# EAGLE design ziggy (EAGLE 9.6.2)
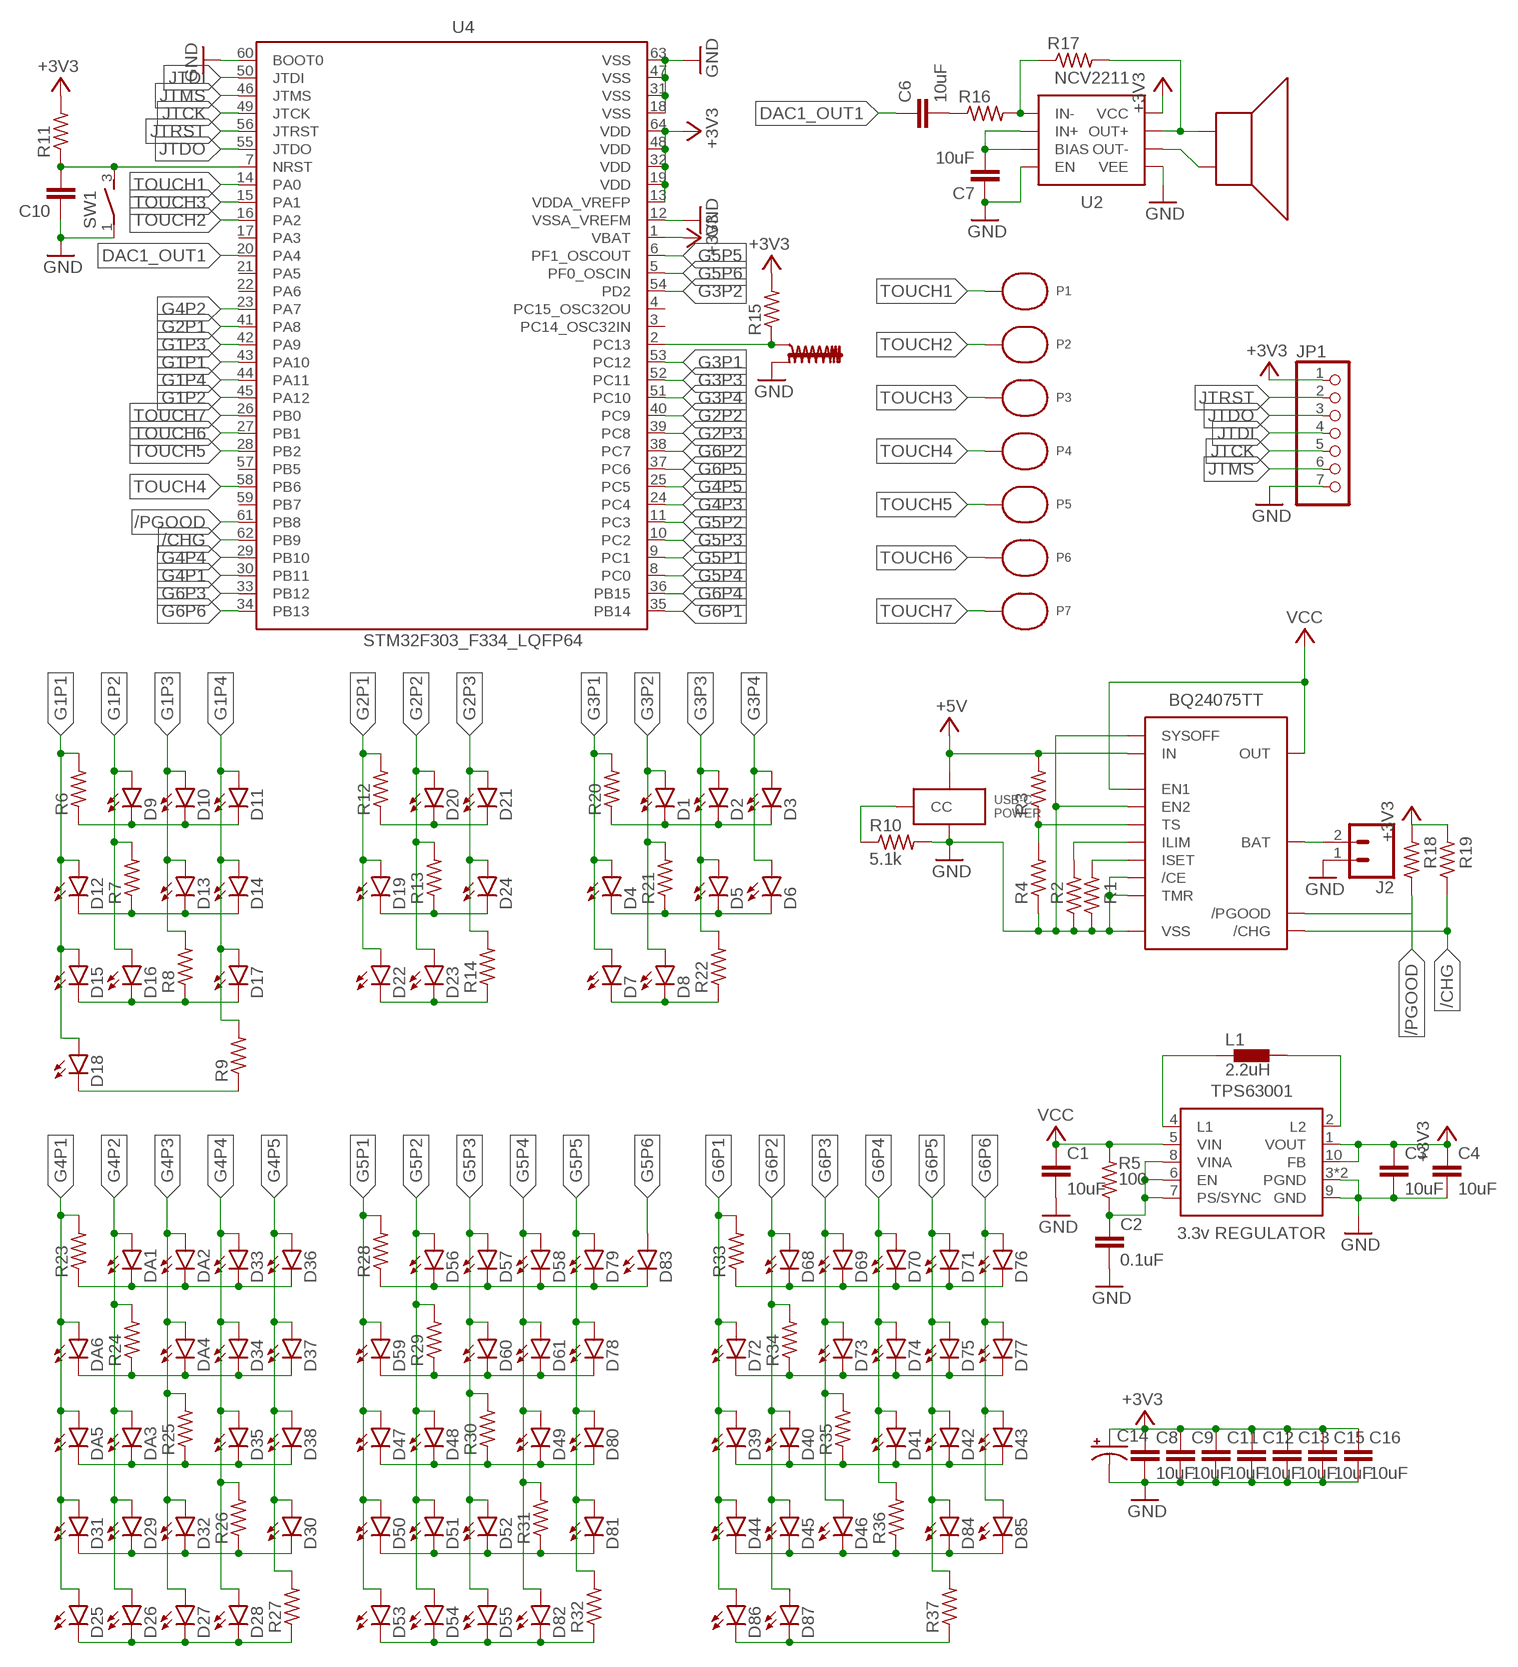
[diagram p0: schematic, sheet 1]

## Parts
C1  10uF  C-EUC0805  [C0805]
C2  0.1uF  C-EUC0805  [C0805]
C3  10uF  C-EUC0805  [C0805]
C4  10uF  C-EUC0805  [C0805]
C6  10uF  C-EUC0805  [C0805]
C7  10uF  C-EUC0805  [C0805]
C8  10uF  C-EUC0805  [C0805]
C9  10uF  C-EUC0805  [C0805]
C10  C-EUC0805  [C0805]
C11  10uF  C-EUC0805  [C0805]
C12  10uF  C-EUC0805  [C0805]
C13  10uF  C-EUC0805  [C0805]
C14  CPOL-US153CLV-0810  [153CLV-0810]
C15  10uF  C-EUC0805  [C0805]
C16  10uF  C-EUC0805  [C0805]
D1  LED-0805  [CHIPLED_0805]
D2  LED-0805  [CHIPLED_0805]
D3  LED-0805  [CHIPLED_0805]
D4  LED-0805  [CHIPLED_0805]
D5  LED-0805  [CHIPLED_0805]
D6  LED-0805  [CHIPLED_0805]
D7  LED-0805  [CHIPLED_0805]
D8  LED-0805  [CHIPLED_0805]
D9  LED-0805  [CHIPLED_0805]
D10  LED-0805  [CHIPLED_0805]
D11  LED-0805  [CHIPLED_0805]
D12  LED-0805  [CHIPLED_0805]
D13  LED-0805  [CHIPLED_0805]
D14  LED-0805  [CHIPLED_0805]
D15  LED-0805  [CHIPLED_0805]
D16  LED-0805  [CHIPLED_0805]
D17  LED-0805  [CHIPLED_0805]
D18  LED-0805  [CHIPLED_0805]
D19  LED-0805  [CHIPLED_0805]
D20  LED-0805  [CHIPLED_0805]
D21  LED-0805  [CHIPLED_0805]
D22  LED-0805  [CHIPLED_0805]
D23  LED-0805  [CHIPLED_0805]
D24  LED-0805  [CHIPLED_0805]
D25  LED-0805  [CHIPLED_0805]
D26  LED-0805  [CHIPLED_0805]
D27  LED-0805  [CHIPLED_0805]
D28  LED-0805  [CHIPLED_0805]
D29  LED-0805  [CHIPLED_0805]
D30  LED-0805  [CHIPLED_0805]
D31  LED-0805  [CHIPLED_0805]
D32  LED-0805  [CHIPLED_0805]
D33  LED-0805  [CHIPLED_0805]
D34  LED-0805  [CHIPLED_0805]
D35  LED-0805  [CHIPLED_0805]
D36  LED-0805  [CHIPLED_0805]
D37  LED-0805  [CHIPLED_0805]
D38  LED-0805  [CHIPLED_0805]
D39  LED-0805  [CHIPLED_0805]
D40  LED-0805  [CHIPLED_0805]
D41  LED-0805  [CHIPLED_0805]
D42  LED-0805  [CHIPLED_0805]
D43  LED-0805  [CHIPLED_0805]
D44  LED-0805  [CHIPLED_0805]
D45  LED-0805  [CHIPLED_0805]
D46  LED-0805  [CHIPLED_0805]
D47  LED-0805  [CHIPLED_0805]
D48  LED-0805  [CHIPLED_0805]
D49  LED-0805  [CHIPLED_0805]
D50  LED-0805  [CHIPLED_0805]
D51  LED-0805  [CHIPLED_0805]
D52  LED-0805  [CHIPLED_0805]
D53  LED-0805  [CHIPLED_0805]
D54  LED-0805  [CHIPLED_0805]
D55  LED-0805  [CHIPLED_0805]
D56  LED-0805  [CHIPLED_0805]
D57  LED-0805  [CHIPLED_0805]
D58  LED-0805  [CHIPLED_0805]
D59  LED-0805  [CHIPLED_0805]
D60  LED-0805  [CHIPLED_0805]
D61  LED-0805  [CHIPLED_0805]
D68  LED-0805  [CHIPLED_0805]
D69  LED-0805  [CHIPLED_0805]
D70  LED-0805  [CHIPLED_0805]
D71  LED-0805  [CHIPLED_0805]
D72  LED-0805  [CHIPLED_0805]
D73  LED-0805  [CHIPLED_0805]
D74  LED-0805  [CHIPLED_0805]
D75  LED-0805  [CHIPLED_0805]
D76  LED-0805  [CHIPLED_0805]
D77  LED-0805  [CHIPLED_0805]
D78  LED-0805  [CHIPLED_0805]
D79  LED-0805  [CHIPLED_0805]
D80  LED-0805  [CHIPLED_0805]
D81  LED-0805  [CHIPLED_0805]
D82  LED-0805  [CHIPLED_0805]
D83  LED-0805  [CHIPLED_0805]
D84  LED-0805  [CHIPLED_0805]
D85  LED-0805  [CHIPLED_0805]
D86  LED-0805  [CHIPLED_0805]
D87  LED-0805  [CHIPLED_0805]
DA1  LED-0805  [CHIPLED_0805]
DA2  LED-0805  [CHIPLED_0805]
DA3  LED-0805  [CHIPLED_0805]
DA4  LED-0805  [CHIPLED_0805]
DA5  LED-0805  [CHIPLED_0805]
DA6  LED-0805  [CHIPLED_0805]
J1  USB-C-POWER  [USB-C]
J2  CONN_02-JST-2MM-SMT  [JST-2-SMD]
JP1  PINHD-1X7/90  [1X07/90]
L1  2.2uH  LPS3015  [LPS3015]
P1  CAPTOUCH  [CAPTOUCH]
P2  CAPTOUCH  [CAPTOUCH]
P3  CAPTOUCH  [CAPTOUCH]
P4  CAPTOUCH  [CAPTOUCH]
P5  CAPTOUCH  [CAPTOUCH]
P6  CAPTOUCH  [CAPTOUCH]
P7  CAPTOUCH  [CAPTOUCH]
R1  R-US_R0805  [R0805]
R2  R-US_R0805  [R0805]
R3  R-US_R0805  [R0805]
R4  R-US_R0805  [R0805]
R5  100  R-US_R0805  [R0805]
R6  R-US_R0805  [R0805]
R7  R-US_R0805  [R0805]
R8  R-US_R0805  [R0805]
R9  R-US_R0805  [R0805]
R10  5.1k  R-US_R0805  [R0805]
R11  R-US_R0805  [R0805]
R12  R-US_R0805  [R0805]
R13  R-US_R0805  [R0805]
R14  R-US_R0805  [R0805]
R15  R-US_R0805  [R0805]
R16  R-US_R0805  [R0805]
R17  R-US_R0805  [R0805]
R18  R-US_R0805  [R0805]
R19  R-US_R0805  [R0805]
R20  R-US_R0805  [R0805]
R21  R-US_R0805  [R0805]
R22  R-US_R0805  [R0805]
R23  R-US_R0805  [R0805]
R24  R-US_R0805  [R0805]
R25  R-US_R0805  [R0805]
R26  R-US_R0805  [R0805]
R27  R-US_R0805  [R0805]
R28  R-US_R0805  [R0805]
R29  R-US_R0805  [R0805]
R30  R-US_R0805  [R0805]
R31  R-US_R0805  [R0805]
R32  R-US_R0805  [R0805]
R33  R-US_R0805  [R0805]
R34  R-US_R0805  [R0805]
R35  R-US_R0805  [R0805]
R36  R-US_R0805  [R0805]
R37  R-US_R0805  [R0805]
SP1  CMS-151103-088SP  [CMS-151103]
SW1  AS11CH  [AS11CH]
SW2  ADAFRUIT1767  [ADAFRUIT1767]
U1  BQ24075TT  [QFN50P300X300X100-17T168N]
U2  NCV2211  [SOIC127P600X175-8N]
U3  TPS63001  [SON50P300X300X100-11T165X240N]
U4  STM32F303_F334_LQFP64  [LQFP64_PACKAGE]

## Nets
+3V3: C3.1 C4.1 C8.1 C9.1 C11.1 C12.1 C13.1 C14.+ C15.1 C16.1 JP1.1 R11.2 R15.2 R18.2 R19.2 U2.6(VCC) U3.1(VOUT) U3.10(FB) U4.1(VBAT) U4.13(VDDA_VREFP) U4.19(VDD) U4.32(VDD) U4.48(VDD) U4.64(VDD)
+5V: J1.VBUS1(VBUS) J1.VBUS2(VBUS) R3.2 U1.13(IN)
/CHG: R19.1 U1.9(/CHG) U4.62(PB9)
/PGOOD: R18.1 U1.7(/PGOOD) U4.61(PB8)
DAC1_OUT1: C6.1 U4.20(PA4)
G1P1: D12.A D15.A D18.A R6.2 U4.43(PA10)
G1P2: D9.A D16.A R7.2 U4.45(PA12)
G1P3: D10.A D13.A R8.2 U4.42(PA9)
G1P4: D11.A D14.A D17.A R9.2 U4.44(PA11)
G2P1: D19.A D22.A R12.2 U4.41(PA8)
G2P2: D20.A D23.A R13.2 U4.40(PC9)
G2P3: D21.A D24.A R14.2 U4.39(PC8)
G3P1: D4.A D7.A R20.2 U4.53(PC12)
G3P2: D1.A D8.A R21.2 U4.54(PD2)
G3P3: D2.A D5.A R22.2 U4.52(PC11)
G3P4: D3.A D6.A U4.51(PC10)
G4P1: D25.A D31.A DA5.A DA6.A R23.2 U4.30(PB11)
G4P2: D26.A D29.A DA1.A DA3.A R24.2 U4.23(PA7)
G4P3: D27.A D32.A DA2.A DA4.A R25.2 U4.24(PC4)
G4P4: D28.A D33.A D34.A D35.A R26.2 U4.29(PB10)
G4P5: D30.A D36.A D37.A D38.A R27.2 U4.25(PC5)
G5P1: D47.A D50.A D53.A D59.A R28.2 U4.9(PC1)
G5P2: D48.A D51.A D54.A D56.A R29.2 U4.11(PC3)
G5P3: D52.A D55.A D57.A D60.A R30.2 U4.10(PC2)
G5P4: D49.A D58.A D61.A D82.A R31.2 U4.8(PC0)
G5P5: D78.A D79.A D80.A D81.A R32.2 U4.6(PF1_OSCOUT)
G5P6: D83.A U4.5(PF0_OSCIN)
G6P1: D39.A D44.A D72.A D86.A R33.2 U4.35(PB14)
G6P2: D40.A D45.A D68.A D87.A R34.2 U4.38(PC7)
G6P3: D46.A D69.A D73.A R35.2 U4.33(PB12)
G6P4: D41.A D70.A D74.A R36.2 U4.36(PB15)
G6P5: D42.A D71.A D75.A D84.A R37.2 U4.37(PC6)
G6P6: D43.A D76.A D77.A D85.A U4.34(PB13)
GND: C1.2 C2.2 C3.2 C4.2 C7.1 C8.2 C9.2 C10.1 C11.2 C12.2 C13.2 C14.- C15.2 C16.2 J1.GND1(GND) J1.GND2(GND) J2.1 JP1.7 R1.1 R2.1 R4.1 R10.2 SW1.1(P) SW2.2(VSS) U1.4(/CE) U1.5(EN2) U1.8(VSS) U1.14(TMR) U1.15(SYSOFF) U1.17(VSS) U2.1(EN) U2.7(VEE) U3.3(PGND) U3.9(GND) U3.11(PGND) U4.12(VSSA_VREFM) U4.18(VSS) U4.31(VSS) U4.47(VSS) U4.60(BOOT0) U4.63(VSS)
JTCK: JP1.5 U4.49(JTCK)
JTDI: JP1.4 U4.50(JTDI)
JTDO: JP1.3 U4.55(JTDO)
JTMS: JP1.6 U4.46(JTMS)
JTRST: JP1.2 U4.56(JTRST)
N$1: R1.2 U1.16(ISET)
N$2: R2.2 U1.12(ILIM)
N$3: J2.2 U1.2(BAT) U1.3(BAT)
N$4: R3.1 R4.2 U1.1(TS)
N$5: L1.1 U3.4(L1)
N$6: L1.2 U3.2(L2)
N$7: C2.1 R5.1 U3.6(EN) U3.7(PS/SYNC) U3.8(VINA)
N$8: D9.C D10.C D11.C R6.1
N$9: D12.C D13.C D14.C R7.1
N$10: D15.C D16.C D17.C R8.1
N$11: D18.C R9.1
N$12: J1.CC1(CC) J1.CC2(CC) R10.1
N$13: D20.C D21.C R12.1
N$14: D19.C D24.C R13.1
N$15: D22.C D23.C R14.1
N$16: R16.2 R17.1 U2.4(IN-)
N$17: C6.2 R16.1
N$18: C7.2 U2.2(BIAS) U2.3(IN+)
N$19: D7.C D8.C R22.1
N$20: R17.2 SP1.2(VSS) U2.5(OUT+)
N$21: D4.C D5.C D6.C R21.1
N$22: D1.C D2.C D3.C R20.1
N$23: SP1.1(VSS) U2.8(OUT-)
N$24: D33.C D36.C DA1.C DA2.C R23.1
N$25: D34.C D37.C DA4.C DA6.C R24.1
N$26: D35.C D38.C DA3.C DA5.C R25.1
N$27: D29.C D30.C D31.C D32.C R26.1
N$28: D25.C D26.C D27.C D28.C R27.1
N$34: D56.C D57.C D58.C D79.C D83.C R28.1
N$35: D59.C D60.C D61.C D78.C R29.1
N$36: D47.C D48.C D49.C D80.C R30.1
N$37: D50.C D51.C D52.C D81.C R31.1
N$38: D53.C D54.C D55.C D82.C R32.1
N$45: D68.C D69.C D70.C D71.C D76.C R33.1
N$46: D72.C D73.C D74.C D75.C D77.C R34.1
N$47: D39.C D40.C D41.C D42.C D43.C R35.1
N$48: D44.C D45.C D46.C D84.C D85.C R36.1
N$49: D86.C D87.C R37.1
NRST: C10.2 R11.1 SW1.3(S) U4.7(NRST)
TOUCH1: P1.P$1 U4.14(PA0)
TOUCH2: P2.P$1 U4.16(PA2)
TOUCH3: P3.P$1 U4.15(PA1)
TOUCH4: P4.P$1 U4.58(PB6)
TOUCH5: P5.P$1 U4.28(PB2)
TOUCH6: P6.P$1 U4.27(PB1)
TOUCH7: P7.P$1 U4.26(PB0)
VCC: C1.1 R5.2 U1.6(EN1) U1.10(OUT) U1.11(OUT) U3.5(VIN)
VIBR_SENS: R15.1 SW2.1(VSS) U4.2(PC13)
Unconnected: U4.3(PC14_OSC32IN) U4.4(PC15_OSC32OU) U4.17(PA3) U4.21(PA5) U4.22(PA6) U4.57(PB5) U4.59(PB7)

## Library data of the parts
C1-C4 C6-C13 C15 C16 = rcl:C-EU: CAPACITOR, European symbol; SPICEPREFIX: C
C14 = rcl:CPOL-US: POLARIZED CAPACITOR, American symbol; SPICEPREFIX: C
D1-D61 D68-D87 DA1-DA6 = ziggy:LED-0805
J1 = ziggy:USB-C-POWER
J2 = SparkFun-Connectors:CONN_02: Multi connection point. Often used as Generic Header-pin footprint for 0.1 inch spaced/style header connections On any of the 0.1 inch spaced packages, you can populate with these: Break Away Headers - Straight <https://www.sparkfun.com/products/116> (PRT-00116) Break Away Male Headers - Right Angle <https://www.sparkfun.com/products/553> (PRT-00553) Female Headers <https://www.sparkfun.com/products/115> (PRT-00115) Break Away Headers - Machine Pin <https://www.sparkfun.com/products/117> (PRT-00117) Break Away Female Headers - Swiss Machine Pin <https://www.sparkfun.com/products/743> (PRT-00743) For SCREWTERMINALS and SPRING TERMINALS visit here: Screw Terimnals on SparkFun.com <https://www.sparkfun.com/search/results?term=Screw+Terminals> (5mm/3.5mm/2.54mm spacing) This device is also useful as a general connection point to wire up your design to another part of your project. Our various solder wires solder well into these plated through hole pads. Hook-Up Wire - Assortment (Stranded, 22 AWG) <https://www.sparkfun.com/products/11375> (PRT-11375) Hook-Up Wire - Assortment (Solid Core, 22 AWG) <https://www.sparkfun.com/products/11367> (PRT-11367) View the entire wire category on our website here <https://www.sparkfun.com/categories/141> Special notes: Molex polarized connector foot print use with: PRT-08233 with associated crimp pins and housings. 2.54_SCREWTERM for use with PRT-10571. 3.5mm Screw Terminal footprints for PRT-08084 5mm Screw Terminal footprints for use with PRT-08432; PROD_ID: CONN-11443
JP1 = pinhead:PINHD-1X7: PIN HEADER
L1 = ziggy:LPS3015
P1-P7 = ziggy:CAPTOUCH
R1-R37 = rcl:R-US_: RESISTOR, American symbol; SPICEPREFIX: R
SP1 = ziggy:CMS-151103-088SP
SW1 = ziggy:AS11CH
SW2 = ziggy:ADAFRUIT1767
U1 = ziggy:BQ24075TT
U2 = ziggy:NCV2211
U3 = ziggy:TPS63001
U4 = ziggy:STM32F303_F334_LQFP64: STM32F303_F334_LQFP64 edit this description Auto generated by make-symbol-device-package-bsdl.ulp Rev. 44 Source: STM32F303_F334_LQFP64.bsd

## Board
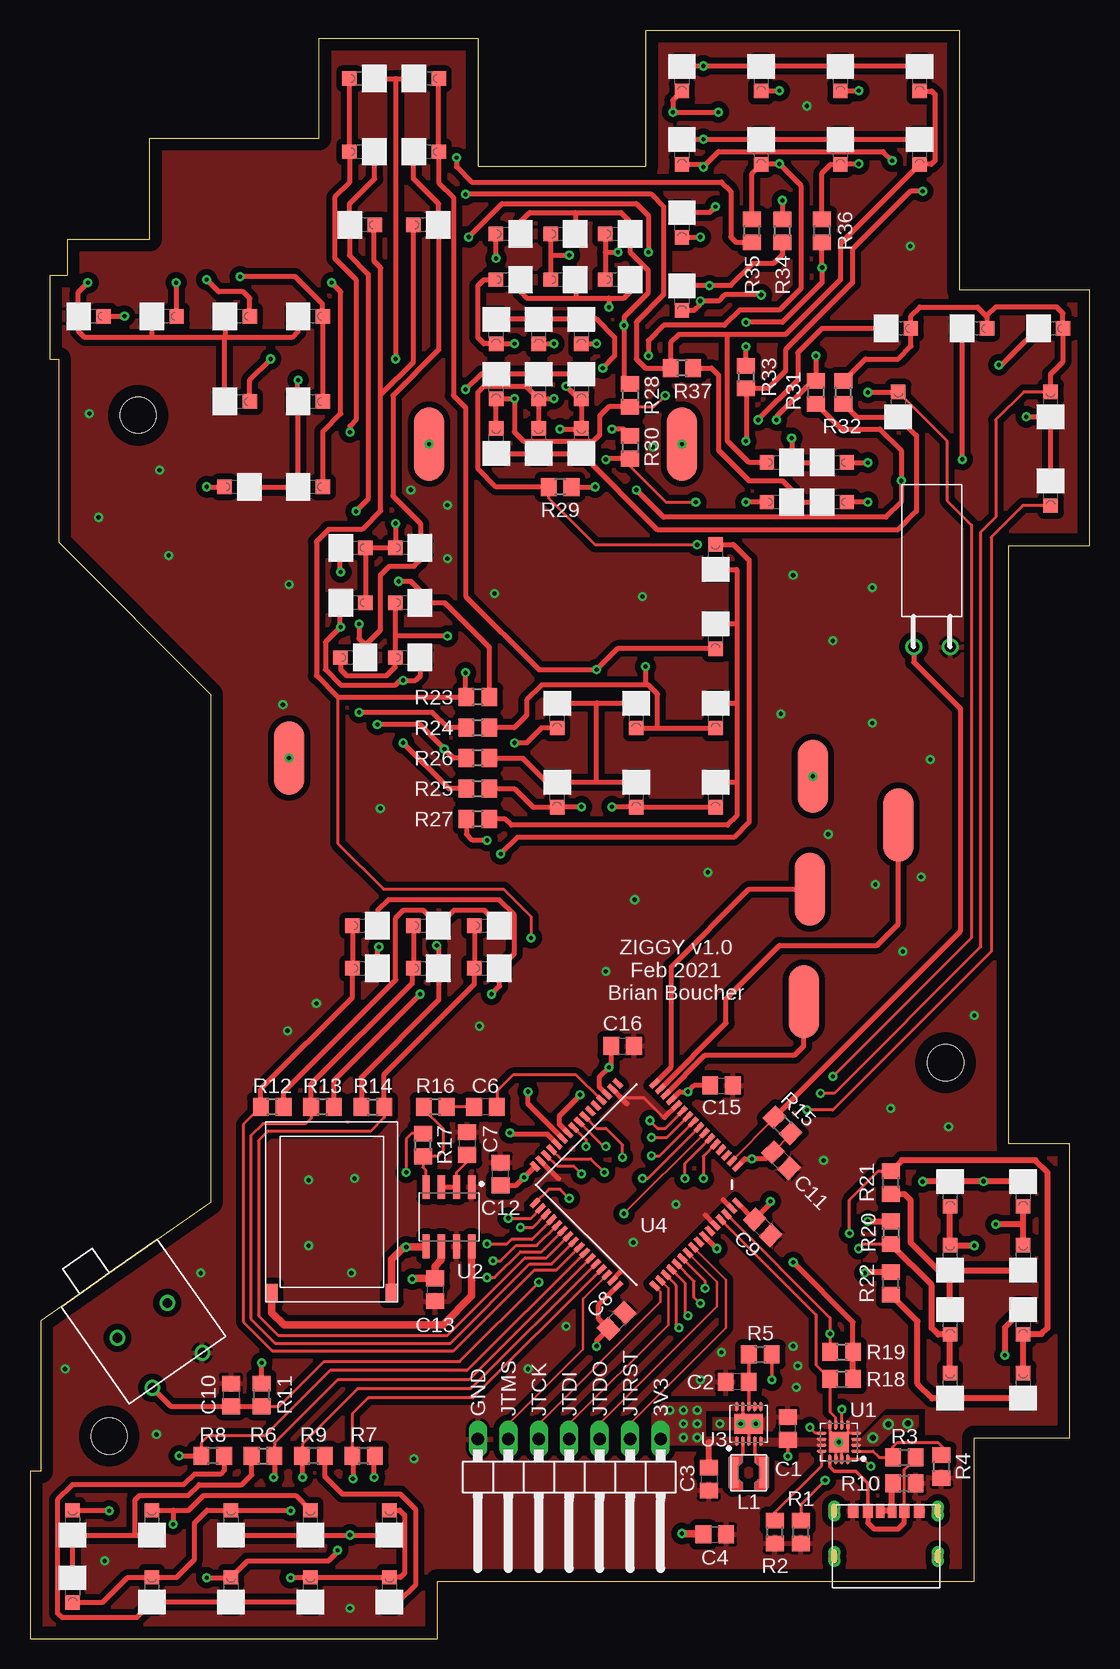
[diagram p1: board, top side]
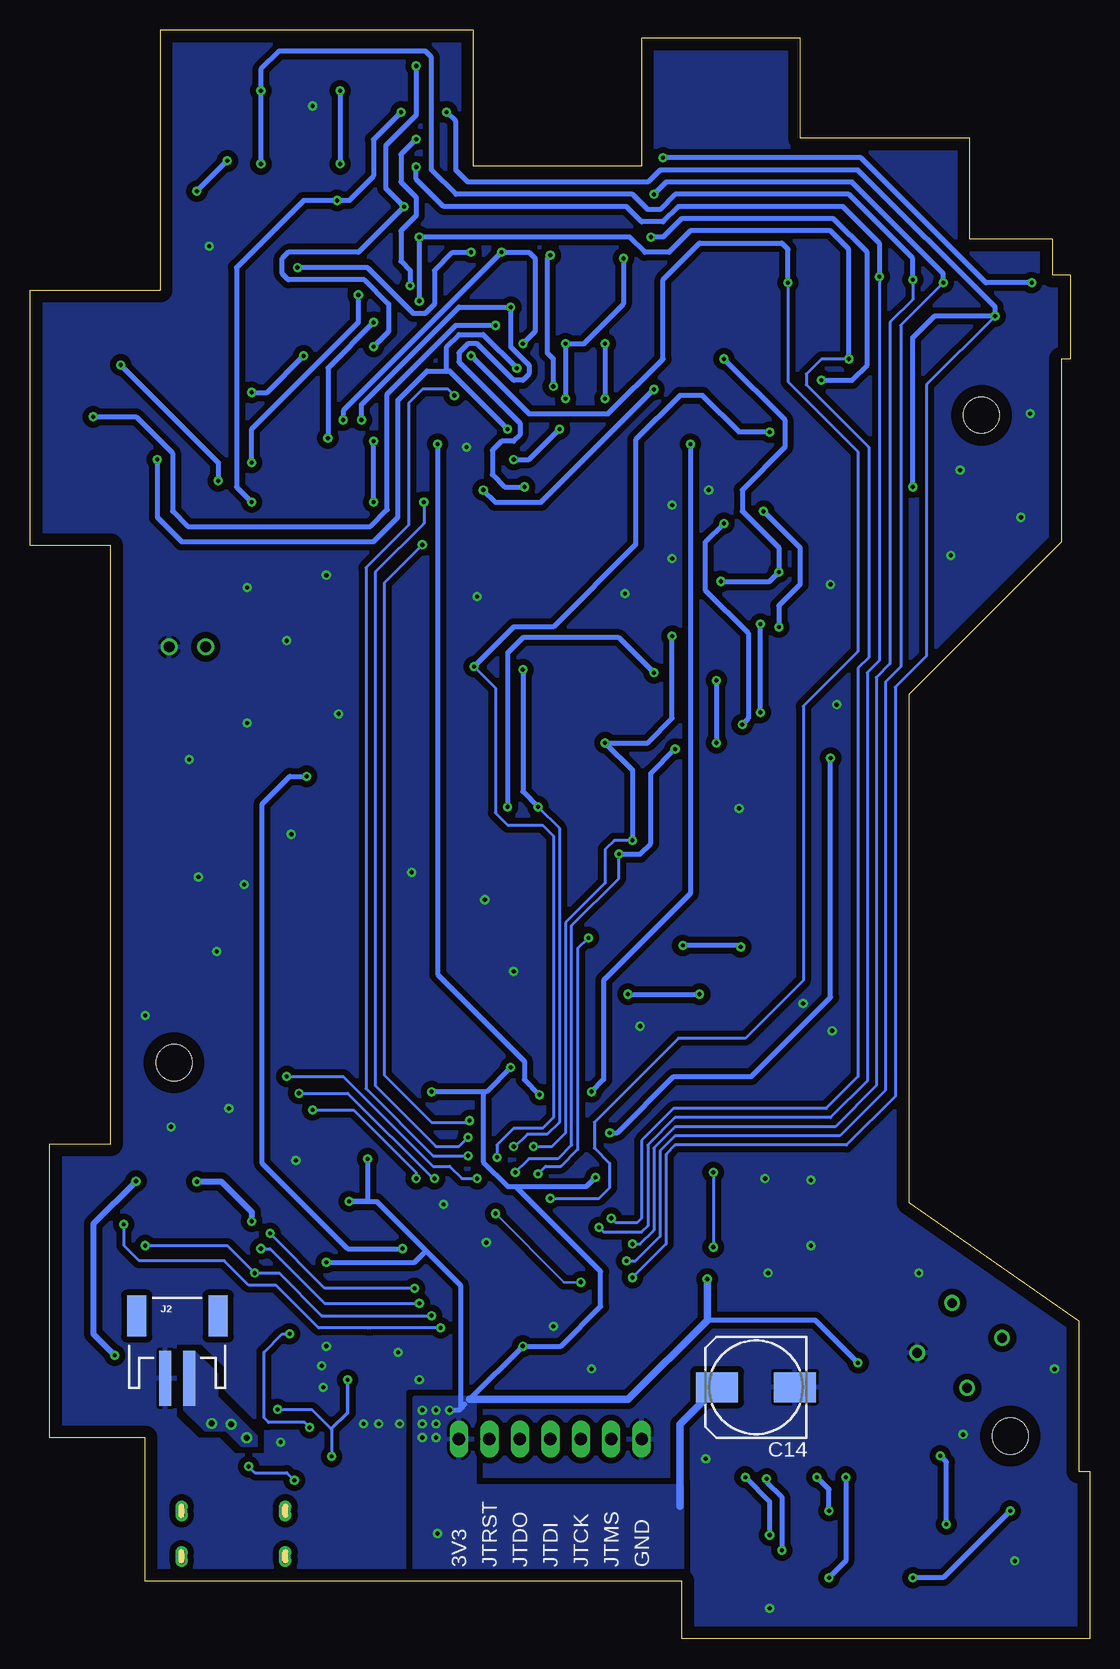
[diagram p2: board, bottom side, seen from below]

Size 88.34 x 134.1 mm. Coordinates in mm from the lower left corner, seen from the top.
Outline: 3.1,116.68 3.1,113.67 1.63,113.67 1.63,106.68 2.38,106.68 2.38,91.39 15.05,78.71 15.05,36.38 0.91,26.48 0.91,13.94 0,13.94 0,0 33.98,0 33.98,4.77 78.74,4.77 78.74,16.74 86.68,16.74 86.68,41.25 81.61,41.25 81.61,91.13 88.33,91.13 88.33,112.41 77.49,112.41 77.49,134.1 51.36,134.1 51.36,122.75 37.34,122.75 37.34,133.39 24.09,133.39 24.09,125.06 9.98,125.06 9.98,116.68 3.1,116.68
Copper layers (1*16): Top 0.035mm / dielectric 1.5mm / Bottom 0.035mm
Design rules "default *": minimum track width 6mil, minimum drill 0.35mm, track to track 6mil, track to pad 6mil, pad to pad 6mil, via to via 6mil, smd to smd 6mil, copper to edge 40mil, drill to drill 6mil, minimum pad ring 10mil, minimum via ring 8mil, stop-mask expansion 4mil, vias tented up to drill 25mil, thermal gap 10mil
Holes 3 mm at 6.6,16.89 76.33,48.01 9.02,101.98

### Footprints (pad centres in the part's own frame; a part is rotated, then mirrored left to right if it is on the bottom)
C0805 = smd 1.3 x 1.5: 1 -0.95,0; 2 0.95,0
153CLV-0810 = smd 3.5 x 2.5: + 3.25,0; - -3.25,0
CHIPLED_0805 = smd 1.2 x 1.2: A 0,-1.05; C 0,1.05
USB-C = smd 0.7 x 1.15: CC1 -0.5,3.8; CC2 0.5,3.8 | smd 0.9 x 1.15: GND1 -2.75,3.8; GND2 2.75,3.8 | drill 0.5 pad 1: SHIELD1 -4.32,-0.35; SHIELD2 -4.32,0.35; SHIELD3 -4.32,3.45; SHIELD4 -4.32,4.15; SHIELD5 4.32,-0.35; SHIELD6 4.32,0.35; SHIELD7 4.32,3.45; SHIELD8 4.32,4.15 | smd 0.8 x 1.15: VBUS1 -1.52,3.8; VBUS2 1.52,3.8
JST-2-SMD = smd 1 x 4.6: 1 -1,-3.7; 2 1,-3.7 | smd 1.6 x 3.4: NC1 -3.4,1.5; NC2 3.4,1.5
1X07/90 = drill 1.016 long: 1 -7.62,-3.81; 2 -5.08,-3.81; 3 -2.54,-3.81; 4 0,-3.81; 5 2.54,-3.81; 6 5.08,-3.81; 7 7.62,-3.81
LPS3015 = smd 0.762 x 2.54: 1 -1.27,0; 2 1.27,0
CAPTOUCH = smd 2.54 x 6.096: P$1 0,0
R0805 = smd 1.3 x 1.5: 1 -0.95,0; 2 0.95,0
CMS-151103 = smd 1 x 1.5: 1 -5,-6.75; 2 5,-6.75
AS11CH = drill 0.8: 1 -2.54,9.9; 3 2.54,9.9; SHIELD1 -2.54,4.82; SHIELD2 2.54,4.82
ADAFRUIT1767 = drill 0.9: 1 1.5,2.54; 2 -1.54,2.54
QFN50P300X300X100-17T168N = smd 0.86 x 0.264: 1 -1.435,0.75; 2 -1.435,0.25; 3 -1.435,-0.25; 4 -1.435,-0.75; 9 1.435,-0.75; 10 1.435,-0.25; 11 1.435,0.25; 12 1.435,0.75 | smd 0.264 x 0.86: 5 -0.75,-1.435; 6 -0.25,-1.435; 7 0.25,-1.435; 8 0.75,-1.435; 13 0.75,1.435; 14 0.25,1.435; 15 -0.25,1.435; 16 -0.75,1.435 | smd 1.68 x 1.68: 17 0,0
SOIC127P600X175-8N = smd 1.968 x 0.602: 1 -2.473,1.905; 2 -2.473,0.635; 3 -2.473,-0.635; 4 -2.473,-1.905; 5 2.473,-1.905; 6 2.473,-0.635; 7 2.473,0.635; 8 2.473,1.905
SON50P300X300X100-11T165X240N = smd 0.86 x 0.27: 1 -1.435,1; 2 -1.435,0.5; 3 -1.435,0; 4 -1.435,-0.5; 5 -1.435,-1; 6 1.435,-1; 7 1.435,-0.5; 8 1.435,0; 9 1.435,0.5; 10 1.435,1 | smd 1.65 x 2.4: 11 0,0
LQFP64_PACKAGE = smd 0.9 x 0.4: 1 -7.05,4.875; 2 -7.05,4.225; 3 -7.05,3.575; 4 -7.05,2.925; 5 -7.05,2.275; 6 -7.05,1.625; 7 -7.05,0.975; 8 -7.05,0.325; 9 -7.05,-0.325; 10 -7.05,-0.975; 11 -7.05,-1.625; 12 -7.05,-2.275; 13 -7.05,-2.925; 14 -7.05,-3.575; 15 -7.05,-4.225; 16 -7.05,-4.875; 33 7.05,-4.875; 34 7.05,-4.225; 35 7.05,-3.575; 36 7.05,-2.925; 37 7.05,-2.275; 38 7.05,-1.625; 39 7.05,-0.975; 40 7.05,-0.325; 41 7.05,0.325; 42 7.05,0.975; 43 7.05,1.625; 44 7.05,2.275; 45 7.05,2.925; 46 7.05,3.575; 47 7.05,4.225; 48 7.05,4.875 | smd 0.4 x 0.9: 17 -4.875,-7.05; 18 -4.225,-7.05; 19 -3.575,-7.05; 20 -2.925,-7.05; 21 -2.275,-7.05; 22 -1.625,-7.05; 23 -0.975,-7.05; 24 -0.325,-7.05; 25 0.325,-7.05; 26 0.975,-7.05; 27 1.625,-7.05; 28 2.275,-7.05; 29 2.925,-7.05; 30 3.575,-7.05; 31 4.225,-7.05; 32 4.875,-7.05; 49 4.875,7.05; 50 4.225,7.05; 51 3.575,7.05; 52 2.925,7.05; 53 2.275,7.05; 54 1.625,7.05; 55 0.975,7.05; 56 0.325,7.05; 57 -0.325,7.05; 58 -0.975,7.05; 59 -1.625,7.05; 60 -2.275,7.05; 61 -2.925,7.05; 62 -3.575,7.05; 63 -4.225,7.05; 64 -4.875,7.05

### Placement (x,y rotation side)
C1  63.17,17.53 90 top
C2  58.95,21.41 180 top
C3  56.59,13.31 270 top
C4  57.1,8.69 0 top
C6  37.97,44.32 180 top
C7  36.45,41.27 270 top
C8  48.91,26.51 45 top
C9  61.09,34.29 315 top
C10  16.76,20.32 270 top
C11  62.61,39.88 315 top
C12  39.24,38.73 90 top
C13  33.78,29.08 270 top
C14  27.81,20.95 180 bottom
C15  57.66,46.1 0 top
C16  49.4,49.4 0 top
D1  82.8,26.42 0 top
D2  76.71,37.08 0 top
D3  82.8,37.08 0 top
D4  76.71,26.42 0 top
D5  76.71,31.75 180 top
D6  82.8,31.75 180 top
D7  76.71,21.08 180 top
D8  82.8,21.08 180 top
D9  3.56,9.65 180 top
D10  10.16,9.65 180 top
D11  3.56,4.06 0 top
D12  29.97,9.65 180 top
D13  23.37,9.65 180 top
D14  16.76,9.65 180 top
D15  23.37,4.06 180 top
D16  16.76,4.06 180 top
D17  10.16,4.06 180 top
D18  29.97,4.06 180 top
D19  27.94,59.44 270 top
D20  33.02,59.44 270 top
D21  38.1,59.44 270 top
D22  27.94,55.88 270 top
D23  33.02,55.88 270 top
D24  38.1,55.88 270 top
D25  57.15,70.36 0 top
D26  57.15,76.96 0 top
D27  57.15,83.57 0 top
D28  57.15,90.17 180 top
D29  50.55,76.96 0 top
D30  43.94,76.96 0 top
D31  50.55,70.36 0 top
D32  43.94,70.36 0 top
D33  26.92,90.93 90 top
D34  31.5,90.93 270 top
D35  26.92,86.36 90 top
D36  31.5,86.36 270 top
D37  26.92,81.79 270 top
D38  31.5,81.79 270 top
D39  23.37,110.24 90 top
D40  5.08,110.24 90 top
D41  17.27,110.24 90 top
D42  11.18,110.24 90 top
D43  17.27,103.12 90 top
D44  23.37,103.12 90 top
D45  17.27,96.01 270 top
D46  23.37,96.01 90 top
D47  38.86,108.97 0 top
D48  42.42,108.97 0 top
D49  45.97,108.97 0 top
D50  38.86,104.39 0 top
D51  42.42,104.39 0 top
D52  45.97,104.39 0 top
D53  38.86,99.82 180 top
D54  42.42,99.82 180 top
D55  45.97,99.82 180 top
D56  39.88,117.09 270 top
D57  44.45,117.09 270 top
D58  49.02,117.09 270 top
D59  39.88,113.28 270 top
D60  44.45,113.28 270 top
D61  49.02,113.28 270 top
D68  54.36,130.05 0 top
D69  60.96,130.05 0 top
D70  67.56,130.05 0 top
D71  74.17,130.05 0 top
D72  54.36,123.95 0 top
D73  60.96,123.95 0 top
D74  67.56,123.95 0 top
D75  74.17,123.95 0 top
D76  54.36,117.86 0 top
D77  54.36,111.76 0 top
D78  72.39,109.22 90 top
D79  85.09,102.87 180 top
D80  78.74,109.22 90 top
D81  85.09,109.22 90 top
D82  72.39,102.87 180 top
D83  85.09,95.5 0 top
D84  62.48,98.04 270 top
D85  67.06,98.04 90 top
D86  62.48,94.74 270 top
D87  67.06,94.74 90 top
DA1  27.69,130.05 270 top
DA2  33.02,130.05 90 top
DA3  27.69,123.95 270 top
DA4  33.02,123.95 90 top
DA5  27.69,117.86 90 top
DA6  33.02,117.86 270 top
J1  71.37,6.86 0 top
J2  76.05,25.4 0 bottom
JP1  44.96,12.83 180 top
L1  59.92,13.84 180 top
P1  64.52,53.09 0 top
P2  65.02,62.48 0 top
P3  72.39,67.82 0 top
P4  65.28,71.88 0 top
P5  21.59,73.41 0 top
P6  33.27,99.57 0 top
P7  54.36,99.57 0 top
R1  64.26,8.89 90 top
R2  62.1,8.89 90 top
R3  72.9,15.11 0 top
R4  76,14.35 90 top
R5  60.88,23.7 0 top
R6  19.43,15.24 0 top
R7  27.81,15.24 180 top
R8  15.24,15.24 180 top
R9  23.62,15.24 180 top
R10  72.9,12.95 0 top
R11  19.3,20.32 90 top
R12  20.19,44.32 180 top
R13  24.38,44.32 180 top
R14  28.57,44.32 0 top
R15  62.74,42.8 315 top
R16  33.78,44.32 180 top
R17  32.77,41.15 90 top
R18  67.67,21.64 0 top
R19  67.67,23.9 0 top
R20  71.78,33.83 270 top
R21  71.78,38.02 90 top
R22  71.78,29.62 90 top
R23  37.34,78.49 180 top
R24  37.34,75.95 0 top
R25  37.34,70.87 0 top
R26  37.34,73.41 180 top
R27  37.34,68.33 180 top
R28  50.04,103.63 270 top
R29  44.2,96.01 180 top
R30  50.04,99.31 270 top
R31  65.53,103.89 90 top
R32  67.82,103.89 90 top
R33  59.69,105.16 270 top
R34  62.74,117.35 90 top
R35  60.2,117.35 90 top
R36  66.04,117.35 90 top
R37  54.36,105.92 180 top
SP1  25.16,35.58 0 top
SW1  6.6,30.48 215 top
SW2  75.18,85.22 180 top
U1  67.44,16.38 180 top
U2  34.92,35.18 270 top
U3  59.92,17.91 90 top
U4  50.55,37.85 225 top

### Tracks (layer width: path | path; a pad name or v marks a point on that pad's centre or on a via)
+3V3  (via drill 0.35)
  Top 0.203: C11.1 63.42,42.03 R15.2
  Top 0.406: R11.2 v19.3,22.99 | U4.48 47.37,27.78 47.37,26.7 C8.1 47.24,24.84 v47.24,24.38 | U4.64 60.33,34.96 C9.1 61.72,36.27 v61.72,36.45 | U4.1 59.6,40.01 v60.2,40.01 61.34,40.01 C11.1 | C12.1 40.52,37.78 v41.18,38.45 U4.32 | R19.2 68.62,26.38 v63.63,31.37 | U4.13 54.16,45.59 v54.86,45.59 55.37,46.1 C15.1 | U4.19 47.5,45.95 47.5,46.86 v48.26,47.62 48.45,47.82 C16.1
  Top 0.508: R18.2 R19.2 | C3.1 56.59,16.38 56.64,16.38
  Top 0.61: U2.6 34.29,31.56 33.78,31.05 C13.1 31.94,30.03 v31.88,29.97 | C4.1 56.07,8.76 v54.36,8.76
  Bottom 0.406: 51.69,19.94 v47.24,24.38 44.07,24.38 40.77,27.69 40.77,30.61 47.85,37.69 | 52.07,19.56 52.45,19.18 | 52.45,19.18 52.58,19.05 v53.34,19.05 | 55.31,32.32 59.44,36.45 v61.72,36.45 60.2,36.45 v60.2,40.01 | 55.31,32.32 52.45,29.46 52.45,19.18 | v19.3,22.99 22.86,26.54 31.88,26.54 | v63.63,31.37 56.26,31.37 55.31,32.32 | v48.26,47.62 50.29,45.59 v54.86,45.59 50.55,45.59 50.55,39.75 48.48,37.69 47.85,37.69 | 47.85,37.69 41.94,37.69 v41.18,38.45
  Bottom 0.61: v31.88,29.97 31.88,26.54 38.48,19.94 51.69,19.94 | C14.+ 34.16,17.86 34.16,11.05
  other vias: 55.63,17.91 55.63,19.05 55.63,16.76 54.48,19.05 54.48,17.91 54.48,16.76
  pour Bottom (isolate 0.508): 34.04,4.83 56.24,4.83 56.24,20.07 51.31,20.07 51.31,12.7 34.04,12.7
  pour Top (no thermals): 59.03,16.84 56.36,16.84 56.36,18.97 59.03,18.97 59.03,19.71 52.73,19.71 51.82,18.8 51.82,16.13 52.78,16.1 59.03,16.1
+5V
  Top 0.254: J1.VBUS2 72.89,14.09 73.85,15.05 R3.2
  Top 0.305: U1.13 66.69,14.34 67.06,13.97 68.83,13.97 69.85,12.95 J1.VBUS1
  Top 0.406: J1.VBUS1 69.85,9.65 70.36,9.14 72.39,9.14 72.89,9.65 J1.VBUS2
/CHG  (via drill 0.35)
  Top 0.203: 66.7,23.92 R19.1
  Top 0.254: U1.9 65.49,17.13 v65.02,17.6 | 66.7,23.92 v66.7,25.4 66.7,26.75 U4.62
  Bottom 0.254: v65.02,17.6 65.46,18.03 68.45,18.03 68.83,18.41 68.83,19.56 68.83,23.88 67.31,25.4 v66.7,25.4
/PGOOD
  Top 0.254: U1.7 67.19,18.41 66.72,18.88 R18.1 65.53,22.82 65.53,27 U4.61
DAC1_OUT1
  Top 0.254: U4.20 45.54,46.99 40.26,46.99 38.92,45.65 C6.1
G1P1  (via drill 0.35)
  Top 0.254: R6.2 20.38,16.32 25.65,21.59 36.59,21.59 U4.43
  Top 0.406: D12.A 30.83,10.7 31.24,10.29 31.24,5.46 30.89,5.11 D18.A D15.A 21.75,5.11 v21.72,5.08 | R6.2 20.38,13.52 v20.32,13.46
  Bottom 0.406: v20.32,13.46 20.32,6.48 v21.72,5.08
G1P2  (via drill 0.35)
  Top 0.254: U4.45 36.9,20.07 28.19,20.07 26.86,18.73 R7.2
  Top 0.406: D9.A 6.57,10.7 v6.6,10.67 | v14.73,5.08 16.73,5.08 D16.A 18.13,6.48 24.89,6.48 25.65,7.24 v25.65,7.37 | R7.2 26.92,15.18 v26.92,13.34
  Bottom 0.406: v6.6,10.67 12.19,5.08 v14.73,5.08 | v26.92,13.34 26.92,13.08 25.65,11.81 v25.65,7.37
G1P3  (via drill 0.35)
  Top 0.254: R8.2 14.29,16.32 14.86,16.89 19.56,16.89 25.02,22.35 36.43,22.35 U4.42
  Top 0.406: D10.A 11.94,10.7 | 11.94,10.7 13.24,10.7 14.48,11.94 22.13,11.94 D13.A | 11.94,10.7 v11.94,9.53 | v12.45,15.24 R8.2
  Bottom 0.406: v11.94,9.53 11.94,14.73 v12.45,15.24
G1P4  (via drill 0.35)
  Top 0.254: 22.73,15.18 22.73,16.26 27.3,20.83 36.74,20.83 U4.44
  Top 0.406: D11.A 6.06,3.01 8.16,5.11 D17.A 12.23,5.11 13.72,6.6 13.72,9.65 14.77,10.7 D14.A 21.68,10.7 v21.72,10.67 | v22.73,13.46 22.73,14.99 22.73,15.18 R9.2
  Bottom 0.406: v22.73,13.46 21.72,12.45 v21.72,10.67
G2P1
  Top 0.254: R12.2 17.78,42.86 17.78,26.42 20.19,24 35.32,24 42.05,30.73 43.89,30.73 U4.41
  Top 0.406: D19.A D22.A 26.89,53.47 19.24,45.82 R12.2
G2P2
  Top 0.254: R13.2 23.43,43.37 22.99,42.93 19.43,42.93 18.41,41.91 18.41,26.67 20.45,24.64 35.05,24.64 41.66,31.24 43.48,31.24 U4.40
  Top 0.406: D20.A D23.A 31.88,55.79 31.88,54.67 23.43,46.23 R13.2
G2P3
  Top 0.254: R14.2 29.52,43.43 28.38,42.29 19.81,42.29 19.05,41.53 19.05,26.92 20.7,25.27 34.8,25.27 41.27,31.75 43.07,31.75 U4.39
  Top 0.406: D21.A D24.A 37.05,54.58 29.52,47.05 R14.2
G3P1  (via drill 0.35)
  Top 0.254: R20.2 69.46,32.88 v69.09,32.51 | v55.88,27.94 55.37,28.45 55.37,29.8 U4.53
  Top 0.508: D7.A D4.A 75.73,25.37 75.18,25.91 75.18,29.48 R20.2
  Bottom 0.254: v69.09,32.51 68.33,32.51 63.75,27.94 v55.88,27.94
G3P2  (via drill 0.35)
  Top 0.254: U4.54 56.28,29.81 v56.28,29.21 | v68.33,33.78 68.33,36.58 70.72,38.97 R21.2
  Top 0.508: D8.A D1.A 82.84,25.4 84.33,25.4 84.84,25.91 84.84,38.86 83.82,39.88 72.69,39.88 R21.2
  Bottom 0.254: v56.28,29.21 63.75,29.21 v68.33,33.78
G3P3  (via drill 0.35)
  Top 0.254: v54.86,26.92 54.61,27.18 54.61,29.64 U4.52
  Top 0.508: D2.A D5.A 78.71,32.8 v78.74,32.77 | v69.6,30.48 69.68,30.57 R22.2
  Bottom 0.254: v78.74,32.77 71.88,32.77 v69.6,30.48 67.56,30.48 64.01,26.92 v54.86,26.92
G3P4  (via drill 0.35)
  Top 0.254: v54.1,25.91 53.85,26.16 53.85,29.49 U4.51
  Top 0.508: D6.A 82.8,34.54 | 82.8,34.54 D3.A | 82.8,34.54 v80.52,34.54
  Bottom 0.254: v80.52,34.54 80.52,32.77 79.25,31.5 72.14,31.5 70.1,29.46 67.82,29.46 64.26,25.91 60.16,25.91 59.94,25.91 v54.1,25.91
G4P1  (via drill 0.35)
  Top 0.254: v41.78,58.42 41.78,60.2 39.5,62.48 29.46,62.48 25.65,66.29 25.65,78.49 | U4.30 43.97,39.37 45.34,39.37 v45.97,38.73
  Top 0.406: 29.24,103.7 31.97,106.43 DA6.A | D25.A D31.A 50.51,69.34 v48.51,69.34 | 29.24,103.7 29.24,94.01 27.69,92.46 24.89,92.46 23.88,91.44 23.88,80.26 25.65,78.49 R23.2 36.32,78.55 v36.32,80.52 | 29.24,103.7 29.24,114.27 28.7,114.81 28.7,117.82 DA5.A
  Bottom 0.254: v41.78,58.42 42.67,57.53 42.67,40.77 44.07,39.37 45.34,39.37 v45.97,38.73
  Bottom 0.406: v36.32,80.52 39.24,83.44 47.24,83.44 48.51,82.17 v48.51,69.34
G4P2  (via drill 0.35)
  Top 0.254: v49.4,40.13 49.4,41.15 48.01,42.55 47.23,42.55 U4.23
  Top 0.406: D29.A 52.32,75.91 | 52.32,75.91 D26.A | 52.32,75.91 52.32,78.74 51.56,79.5 51.31,79.5 | R24.2 40.39,75.95 41.4,76.96 41.4,78.23 42.67,79.5 51.31,79.5 | DA1.A DA3.A 26.64,121.38 25.4,120.14 25.4,115.06 27.18,113.28 27.18,101.6 26.67,101.09 v26.67,100.58 | v51.31,81.03 51.31,79.5
  Bottom 0.254: v51.31,81.03 49.53,79.25 49.53,68.83 48.51,67.82 45.59,67.82 44.7,66.93 44.7,43.43 45.59,42.55 48.01,42.55 49.4,41.15 v49.4,40.13
  Bottom 0.406: v26.67,100.58 29.21,100.58 32.26,103.63 34.16,103.63 37.85,99.95 37.85,91.19 44.7,84.33 48.01,84.33 v51.31,81.03
G4P3  (via drill 0.35)
  Top 0.254: U4.24 47.83,41.02 v48.01,41.02
  Top 0.406: D27.A 48.99,82.52 v47.24,80.77 42.42,80.77 36.32,86.87 36.32,102.62 35.31,103.63 35.31,120.14 34.07,121.38 DA4.A DA2.A | v45.97,69.34 45.94,69.31 D32.A 41.94,69.31 40.39,70.87 R25.2
  Bottom 0.254: v45.97,69.34 44.2,67.56 44.2,43.05 45.21,42.04 46.86,42.04 47.88,41.02 v48.01,41.02
  Bottom 0.406: v47.24,80.77 47.24,70.61 v45.97,69.34
G4P4  (via drill 0.35)
  Top 0.254: U4.29 44.25,40.01 46.74,40.01 v47.88,38.86
  Top 0.406: D35.A D33.A D34.A 30.48,90.97 v30.48,92.96 | R26.2 35.31,73.41 v34.54,74.17 32.51,76.2 v28.96,76.2 | D28.A 58.64,91.22 59.94,89.92 59.94,68.07 58.67,66.8 40.64,66.8 v39.24,65.41
  Bottom 0.254: v47.88,38.86 46.74,40.01 44.32,40.01 43.18,41.15 43.18,59.44 39.24,63.37 v39.24,65.41
  Bottom 0.406: v28.96,76.2 28.45,76.71 28.45,83.82 32,87.38 32,91.44 v30.48,92.96 | v39.24,65.41 37.47,65.41 36.58,66.29 36.58,72.14 v34.54,74.17
G4P5  (via drill 0.35)
  Top 0.254: U4.25 46.35,41.58 v46.35,41.02
  Top 0.406: D36.A 30.45,83.57 | 30.45,83.57 D38.A 30.45,80.99 29.72,80.26 26.42,80.26 25.91,80.77 25.91,81.75 D37.A | D30.A 42.64,75.91 41.4,74.68 v40.39,74.68 | R27.2 36.39,67.06 36.9,66.55 v38.1,66.55 | v34.8,83.57 30.45,83.57
  Bottom 0.254: v38.1,66.55 39.62,66.55 40.39,65.79 40.39,62.99 43.69,59.69 43.69,42.16 44.83,41.02 v46.35,41.02
  Bottom 0.406: v38.1,66.55 38.1,72.39 v40.39,74.68 36.83,74.68 34.8,76.71 v34.8,83.57
G5P1  (via drill 0.35)
  Top 0.254: R28.2 52.01,102.68 v52.96,103.63 | v51.82,40.26 52.5,40.26 U4.9
  Top 0.406: D53.A D50.A 38.9,103.38 v40.39,103.38 40.39,100.58 41.15,99.82 46.99,99.82 47.5,100.33 47.5,101.92 48.26,102.68 R28.2 | v40.39,107.95 40.35,107.92 D47.A 38.83,107.95 37.85,107.95 37.34,108.46 37.34,112.78 37.85,113.28 D59.A
  Bottom 0.254: v52.96,103.63 53.47,104.14 55.63,104.14 56.77,103 56.77,92.84 60.33,89.28 60.33,45.85 54.74,40.26 v51.82,40.26
  Bottom 0.406: v40.39,107.95 v40.39,103.38
G5P2  (via drill 0.35)
  Top 0.254: R29.2 43.25,95.06 47.12,91.19 v55.63,91.19 | v51.69,43.18 52.32,42.55 52.96,42.55 54.38,43.97 U4.11
  Top 0.406: D54.A D51.A | D48.A 42.45,107.95 v43.69,107.95 | v43.69,103.38 43.65,103.34 D51.A | v38.86,115.06 38.86,117.06 D56.A | R29.2 38.86,96.01 37.34,97.54 37.34,103.89 37.85,104.39 41.37,104.39 D51.A
  Bottom 0.254: v55.63,91.19 58.8,88.01 58.8,46.99 54.86,43.05 51.82,43.05 v51.69,43.18
  Bottom 0.406: v43.69,103.38 v43.69,107.95 42.16,107.95 38.86,111.25 v38.86,115.06
G5P3  (via drill 0.35)
  Top 0.254: R30.2 50.04,97.73 53.02,94.74 v55.5,94.74 | U4.10 53.1,41.78 v51.82,41.78
  Top 0.406: D57.A 43.4,115.32 | 43.4,115.32 D60.A | 43.4,115.32 v44.96,115.32 | v44.7,104.39 45.75,103.34 D52.A D55.A 45.94,100.84 v44.2,100.84 | v48.01,98.3 48.07,98.36 R30.2
  Bottom 0.254: v55.5,94.74 55.5,92.96 59.56,88.9 59.56,46.1 54.48,41.02 52.58,41.02 v51.82,41.78
  Bottom 0.406: v44.7,104.39 44.7,106.68 45.21,107.19 45.21,115.06 v44.96,115.32 | v48.01,98.3 46.74,98.3 v44.2,100.84
G5P4  (via drill 0.35)
  Top 0.254: D82.A 76.45,99.86 76.45,94.87 78.49,92.84 78.49,58.42 v66.93,46.86 | U4.8 51.51,38.35 v51.05,38.35
  Top 0.406: D58.A 47.97,115.57 | 47.97,115.57 D61.A | 47.97,115.57 v49.02,115.57 | v47.24,107.95 47.21,107.92 D49.A | v62.23,101.6 62.23,101.85 65.21,104.84 R31.2 v65.53,106.93 | D82.A 72.36,103.89 v69.85,103.89
  Bottom 0.254: v51.05,38.35 52.32,38.35 53.34,39.37 54.74,39.37 62.23,46.86 v66.93,46.86
  Bottom 0.406: v47.24,107.95 46.23,108.97 46.23,115.06 46.74,115.57 v49.02,115.57 62.23,102.36 v62.23,101.6 | v69.85,103.89 68.58,103.89 v65.53,106.93
G5P5  (via drill 0.35)
  Top 0.254: D79.A 82.84,103.92 80.52,101.6 80.52,93.47 79.25,92.2 79.25,57.66 67.06,45.47 v65.91,45.47 | v54.61,38.35 54.61,39.61 U4.6
  Top 0.406: D79.A 85.09,105.41 86.14,106.46 D81.A 86.11,109.25 86.11,110.49 85.6,111 80.52,111 79.79,110.27 79.79,110.2 | 79.79,110.2 D80.A | 79.79,110.2 78.99,111 74.17,111 73.44,110.27 D78.A 73.44,107.73 72.39,106.68 69.66,106.68 R32.2
  Bottom 0.254: v65.91,45.47 61.85,45.47 54.74,38.35 v54.61,38.35
G5P6  (via drill 0.35)
  Top 0.254: D83.A 82.77,94.45 80.14,91.82 80.14,57.28 66.93,44.07 v64.77,44.07 | U4.5 56.13,40.22 v56.13,38.35
  Bottom 0.254: v64.77,44.07 61.34,44.07 56.13,38.86 v56.13,38.35
G6P1  (via drill 0.35)
  Top 0.254: U4.35 41.93,34.29 v40.89,34.29
  Top 0.406: D44.A D39.A 24.38,110.27 24.38,111.25 22.1,113.54 v17.53,113.54 | 54.39,122.94 D72.A 55.91,122.9 v56.13,122.68 57.4,123.95 71.12,123.95 v71.88,123.19 | v74.42,120.65 73.41,120.65 68.58,115.82 68.58,113.03 62.99,107.44 62.99,105.66 61.53,104.21 R33.2 59.74,104.16 59.74,99.87 v59.69,99.82 | D86.A v59.69,94.74
  Bottom 0.254: v17.53,113.54 17.53,81.53 18.54,80.52 18.54,46.48 21.59,43.43 34.54,43.43 36.83,41.15 36.83,34.42 37.34,33.91 40.51,33.91 v40.89,34.29
  Bottom 0.406: v17.53,113.54 17.53,116.33 20.57,119.38 34.29,119.38 35.56,118.11 37.34,118.11 38.61,119.38 53.85,119.38 56.13,121.67 v56.13,122.68 | v71.88,123.19 v74.42,120.65 | v59.69,94.74 v59.69,99.82
G6P2  (via drill 0.35)
  Top 0.254: v38.1,30.1 38.73,30.1 40.89,32.26 42.66,32.26 U4.38
  Top 0.406: D40.A v7.87,110.24 | v14.73,96.01 D45.A | D68.A 53.59,128.24 v53.59,127.25 v57.4,127.25 | v62.74,119.89 R34.2 | v69.85,94.74 D87.A
  Bottom 0.254: v7.87,110.24 13.59,104.52 13.59,81.92 16.19,79.31 16.19,45.21 20.26,41.15 34.54,41.15 35.31,40.39 35.31,32.89 v38.1,30.1
  Bottom 0.406: v14.73,96.01 14.73,108.46 12.95,110.24 v7.87,110.24 7.87,111 19.3,122.43 35.81,122.43 36.83,121.41 51.82,121.41 52.83,122.43 52.83,126.49 v53.59,127.25 | v57.4,127.25 59.69,124.97 59.69,121.92 61.72,119.89 v62.74,119.89 65.53,119.89 71.12,114.3 71.12,96.01 v69.85,94.74
G6P3  (via drill 0.35)
  Top 0.254: U4.33 43.27,37.47 44.2,37.47 v44.96,36.7
  Top 0.406: D69.A 60.99,129.03 v62.48,129.03 | D46.A 24.42,100.62 25.91,102.11 25.91,112.27 v25.15,113.03 | R35.2 60.2,122.14 D73.A 62.45,122.9 v62.48,122.94 64.26,121.16 64.26,112.52 62.48,110.74 59.18,110.74 57.91,109.47 52.83,109.47 51.56,108.2 v51.56,106.93
  Bottom 0.254: v25.15,113.03 25.15,104.78 19.3,98.93 19.3,82.3 23.88,77.72 23.88,54.86 28.7,50.04 34.29,50.04 41.27,43.05 41.27,40.89 40.01,39.62 40.01,37.59 40.89,36.7 v44.96,36.7
  Bottom 0.406: v62.48,129.03 v62.48,122.94 | v25.15,113.03 25.15,115.82 25.65,116.33 32.51,116.33 35.56,113.28 35.56,106.68 40.13,102.11 46.74,102.11 v51.56,106.93
G6P4  (via drill 0.35)
  Top 0.254: U4.36 41.84,33.27 40.13,33.27 39.75,32.89 v38.1,32.89
  Top 0.406: D70.A 67.6,129.03 v69.09,129.03 | v69.09,122.94 69.05,122.9 D74.A 66.77,122.9 66.04,122.17 R36.2 | D41.A 18.32,111.73 17.78,112.27 15.75,112.27 v14.73,113.28
  Bottom 0.254: v14.73,113.28 14.73,111.63 16.64,109.73 16.64,81.28 17.78,80.14 17.78,46.1 21.21,42.67 34.54,42.67 36.32,40.89 36.32,34.04 37.47,32.89 v38.1,32.89
  Bottom 0.406: v69.09,122.94 v69.09,129.03 69.09,130.81 67.56,132.33 55.37,132.33 54.86,131.83 54.86,122.43 52.83,120.4 38.1,120.4 36.83,119.13 35.81,119.13 34.54,120.4 20.07,120.4 14.73,115.06 v14.73,113.28
G6P5  (via drill 0.35)
  Top 0.254: v38.61,31.5 39.24,31.5 40.51,32.77 42.25,32.77 U4.37
  Top 0.406: D71.A 75.18,129 75.44,128.74 75.44,123.19 75.15,122.9 D75.A 67.56,116.3 67.56,113.28 62.99,108.71 58.17,108.71 | D42.A 12.23,113 v12.19,113.03 | v36.32,120.4 51.82,120.4 52.83,119.38 52.83,112.01 50.55,109.73 50.55,106.68 51.31,105.92 R37.2 53.41,108.02 54.1,108.71 58.17,108.71 | D84.A 59.94,98.04 58.17,99.82 58.17,108.71
  Bottom 0.254: v12.19,113.03 15.75,109.47 15.75,81.03 17.02,79.76 17.02,45.72 20.83,41.91 34.54,41.91 35.81,40.64 35.81,33.53 37.85,31.5 v38.61,31.5
  Bottom 0.406: v12.19,113.03 12.19,113.79 19.81,121.41 35.31,121.41 v36.32,120.4
G6P6  (via drill 0.35)
  Top 0.254: v39.88,35.05 41.78,35.05 U4.34
  Top 0.406: D76.A 55.85,116.81 v55.88,116.84 | D77.A 55.37,110.71 55.88,111.22 v55.88,111.51 57.4,111.51 57.91,112.01 v60.96,112.01 | D43.A 18.32,104.94 v20.07,106.68 | D85.A v69.85,98.04
  Bottom 0.254: v20.07,106.68 22.35,106.68 23.62,105.41 23.62,104.52 18.41,99.31 18.41,81.79 19.3,80.9 19.3,46.86 21.97,44.2 34.67,44.2 37.34,41.53 37.34,35.05 37.72,34.67 39.5,34.67 v39.88,35.05
  Bottom 0.406: v55.88,111.51 v55.88,116.84 38.35,116.84 37.08,115.57 35.05,115.57 33.27,117.35 21.59,117.35 20.07,115.82 v20.07,106.68 | v69.85,98.04 69.85,100.84 60.96,109.73 v60.96,112.01
GND  (via drill 0.35)
  Top 0.254: U1.17 67.5,16.32 67.19,16.01 U1.14 | 66.69,17.54 U1.8 66.69,17.33 66.71,17.3 66.71,17.11 U1.17 | U1.5 68.19,17.13 | U1.4 68.19,17.13 | 68.19,17.13 U1.17 | U1.15 67.69,16.13 U1.17 | 52.92,43.43 52.83,43.43 51.18,45.09 49.28,45.09
  Top 0.305: U3.3 U3.11 | U3.9 59.42,18.07 v59.26,17.91
  Top 0.406: U4.47 49.28,30.6 | U4.31 44.06,38.35 | U4.63 57.78,36.58 | U4.60 56.3,35.31 | U4.18 49.28,45.09 49.78,44.58 | U4.12 52.92,43.43
  other vias: 67.44,16.38 60.53,17.91 57.51,17.91 55.88,21.59 57.66,23.88 64.01,22.73 63.88,20.95 63.63,24.38 23.24,38.23 27.05,38.35 23.24,32.77 26.8,30.48 14.22,30.48 2.92,22.48 10.54,17.02 6.22,6.48 26.67,2.54 32,14.99 50.29,33.02 53.85,36.2 44.7,26.04 41.53,22.48 66.17,39.88 71.75,44.2 76.58,42.67 78.74,51.94 72.77,57.28 66.55,67.06 70.48,62.87 74.3,63.5 62.61,77.09 66.93,83.19 63.63,88.65 70.23,76.33 70.23,87.63 50.42,61.59 48.01,55.63 56.52,63.88 51.05,86.87 38.73,87.12 29.21,69.22 21.59,87.88 11.56,90.3 5.71,93.47 10.79,97.41 4.95,102.11 73.41,116.08 64.77,127.76 51.94,99.31 34.8,94.49 34.8,90.04 31.75,95.76 21.08,77.85 21.46,50.67 23.88,52.96 37.47,51.05 75.06,73.28
  pour Top (isolate 0.508, rank 2): 0,0 34.04,0 34.04,4.57 34.04,4.83 78.74,4.83 78.74,16.76 86.61,16.76 86.61,41.15 81.53,41.15 81.53,91.19 88.39,91.19 88.39,112.52 77.47,112.52 77.47,134.11 51.31,134.11 51.31,122.68 37.34,122.68 37.34,133.35 24.13,133.35 24.13,124.97 9.91,124.97 9.91,116.59 3.05,116.59 3.05,113.54 1.52,113.54 1.52,106.68 2.29,106.68 2.29,91.44 14.99,78.74 14.99,36.32 0.76,26.42 0.76,13.97 0,13.97
  pour Bottom (isolate 0.508, rank 2): 0,0 34.04,0 34.04,4.83 78.74,4.83 78.74,16.76 86.61,16.76 86.61,41.15 81.53,41.15 81.53,91.19 88.39,91.19 88.39,112.52 77.47,112.52 77.47,134.11 51.31,134.11 51.31,122.68 37.34,122.68 37.34,133.35 24.13,133.35 24.13,124.97 9.91,124.97 9.91,116.59 3.05,116.59 3.05,113.54 1.52,113.54 1.52,106.68 2.29,106.68 2.29,91.44 14.99,78.74 14.99,36.32 0.76,26.42 0.76,13.97 0,13.97
  pour Top (no thermals): 68.12,18.21 69.7,19.79 71.37,19.79 71.37,19.18 69.22,17.02 68.12,17.02
  pour Top (no thermals): 66.55,17.5 66.24,17.5 65.91,17.83 65.91,18.41 65.94,18.44 66.29,18.44 66.5,18.24 66.73,18.24 66.8,18.16 66.8,17.5
JTCK
  Top 0.203: JP1.5 42.42,17.91 52.58,28.07 52.58,28.92 U4.49
JTDI
  Top 0.203: JP1.4 44.96,17.91 53.21,26.16 53.21,29.2 U4.50
JTDO
  Top 0.203: U4.55 57.28,29.74 57.28,27.69 47.5,17.91 JP1.3
JTMS
  Top 0.203: JP1.6 39.88,17.91 46.1,24.13 46.1,28.34 U4.46
JTRST
  Top 0.203: U4.56 58.04,29.89 58.04,25.91 50.04,17.91 JP1.2
N$1  (via drill 0.35)
  Top 0.254: v70.1,14.35 69.51,14.95 U1.16 | v66.29,13.21 64.26,11.18 R1.2
  Bottom 0.254: v70.1,14.35 69.6,13.84 66.93,13.84 v66.29,13.21
N$2
  Top 0.254: R2.2 62.1,10.52 66,14.41 U1.12
N$3  (via drill 0.5)
  other vias: 70.28,16.74 71.55,17.88 73.2,17.93
  pour Top (no thermals): 68.5,16.74 69.32,16.74 71.18,18.61 74.12,18.6 74.12,17.7 73.66,17.25 71.96,17.25 70.74,16.03 68.5,16.03
  pour Bottom (no thermals): 69.34,16 69.34,16.89 72.64,20.19 72.64,22.1 74.55,24 75.56,24 75.56,19.05 73.79,17.27 72.01,17.27 70.74,16
N$4
  Top 0.254: U1.1 70.28,15.63 70.81,15.11 R3.1 71.95,15.99 72.31,16.36 75.69,16.36 76.02,16.03 76.02,15.33 R4.2
N$5
  Top 0.305: U3.4 60.42,15.45 61.19,14.68 L1.1
N$6
  Top 0.305: U3.2 59.42,15.43 58.65,14.66 L1.2
N$7
  Top 0.305: U3.6 U3.7 U3.8 59.92,21.4 C2.1 59.93,21.44 R5.1
N$8
  Top 0.406: 8.76,8.6 D9.C D11.C | 8.76,8.6 D10.C | 8.76,8.6 8.76,11.56 9.14,11.94 13.21,11.94 14.1,12.83 17.65,12.83 18.48,13.65 R6.1
N$9  (via drill 0.35)
  Top 0.406: D14.C D13.C 23.4,8.64 v26.67,8.64 29.94,8.64 D12.C | v28.7,13.46 28.7,15.18 R7.1
  Bottom 0.406: v26.67,8.64 26.67,11.43 v28.7,13.46
N$10
  Top 0.406: D15.C D16.C D17.C 8.92,1.78 2.67,1.78 2.29,2.16 2.29,11.56 3.56,12.83 12.83,12.83 13.72,13.72 15.88,13.72 16.19,14.03 R8.1
N$11
  Top 0.406: R9.1 24.57,13.53 26.04,12.06 30.86,12.06 32.13,10.79 32.13,4.45 30.7,3.01 D18.C
N$12
  Top 0.508: J1.CC1 J1.CC2 71.87,12.88 R10.1
N$13
  Top 0.406: D21.C 37.88,60.71 35.34,60.71 D20.C 32.8,60.71 31.11,60.71 30.48,60.07 30.48,54.93 21.14,45.59 R12.1
N$14  (via drill 0.35)
  Top 0.406: D19.C 28.99,60.71 29.88,61.59 39.12,61.59 40.39,60.33 40.39,57.12 D24.C 39.15,54.39 v38.48,53.72 | R13.1 25.33,46.54 v32.51,53.72
  Bottom 0.406: v38.48,53.72 v32.51,53.72
N$15  (via drill 0.35)
  Top 0.406: D22.C 28.99,57.56 v29.08,57.66 | v33.91,57.78 34.07,57.62 D23.C 34.07,53.25 27.62,46.8 R14.1
  Bottom 0.406: v29.08,57.66 29.21,57.78 v33.91,57.78
N$16
  Top 0.254: U2.4 33.02,39.05 32.77,39.3 R17.1 33.98,40.2 34.42,40.64 34.42,42.55 32.83,44.13 R16.2
N$17
  Top 0.254: C6.2 R16.1
N$18
  Top 0.254: U2.2 35.56,38.86 36.45,39.75 C7.2
  Top 0.406: U2.3 U2.2
N$19
  Top 0.508: D8.C D7.C 75.22,20.03 73.99,21.26 73.99,26.46 R22.1
N$20  (via drill 0.35)
  Top 0.254: R17.2 31.81,42.1 31.37,41.66 v31.37,38.86
  Top 0.406: 32.95,32.64 U2.5
  Top 0.61: 32.95,32.64 v31.37,32.64 31.18,32.64 30.16,31.62 SP1.2
  Bottom 0.254: v31.37,38.86 v31.37,32.64
N$21
  Top 0.508: D4.C D5.C | D5.C D6.C | R21.1 72.91,37.07 73.41,36.58 73.41,33.02 75.73,30.7 D5.C
N$22  (via drill 0.35)
  Top 0.508: D3.C v79.5,38.13 D2.C 74.46,38.13 v74.42,38.1 | v69.85,34.8 71.77,34.8 R20.1 | D1.C 81.28,25.94 v81.28,23.62
  Bottom 0.508: v74.42,38.1 72.39,38.1 69.85,35.56 v69.85,34.8 | v81.28,23.62 83.06,25.4 83.06,34.58 v79.5,38.13
N$23
  Top 0.61: SP1.1 20.16,27.17 21.17,26.16 34.42,26.16 36.83,28.57 U2.8
N$24  (via drill 0.35)
  Top 0.406: DA1.C 30.48,130.05 | 30.48,130.05 DA2.C | v30.73,88.14 31.75,88.14 32.55,87.34 D36.C 34.58,86.36 38.29,82.65 R23.1 | v25.91,88.9 25.87,88.93 D33.C | 30.48,130.05 v30.48,106.68
  Bottom 0.406: v30.73,88.14 26.67,88.14 v25.91,88.9 25.91,90.93 28.96,93.98 28.96,95.76 25.4,99.31 25.4,101.6 v30.48,106.68
N$25  (via drill 0.35)
  Top 0.406: D37.C 27.97,82.84 | 27.97,82.84 29.21,84.07 29.21,88.65 29.97,89.41 32.04,89.41 32.55,89.92 D34.C 32.55,92.96 30.26,95.25 30.26,103.63 34.07,107.44 DA6.C 34.07,119.6 31.97,121.7 DA4.C | R24.1 34.8,75.95 33.53,77.22 v27.43,77.22 | v27.43,84.58 27.43,83.38 27.97,82.84
  Bottom 0.406: v27.43,77.22 v27.43,84.58
N$26  (via drill 0.35)
  Top 0.406: DA3.C 28.74,121.7 26.64,119.6 DA5.C 26.64,115.32 28.19,113.76 28.19,95 v27.18,93.98 | D35.C 25.87,84.36 v25.91,84.33 24.64,83.06 24.64,80.77 25.91,79.5 30.48,79.5 30.86,79.88 v31.11,79.88 32.13,79.88 32.55,80.3 D38.C | R25.1 34.92,70.87 v31.11,74.68
  Bottom 0.406: v27.18,93.98 24.13,90.93 24.13,87.88 25.91,86.11 v25.91,84.33 | v31.11,79.88 v31.11,74.68
N$27
  Top 0.406: D30.C 47.24,78.01 | 47.24,78.01 D29.C | 47.24,71.41 D32.C 43.08,71.41 41.08,73.41 R26.1 | 47.24,71.41 D31.C | 47.24,71.41 47.24,78.01
N$28
  Top 0.406: D26.C 57.15,77.98 58.93,77.98 | D25.C 58.93,71.41 | 58.93,77.98 58.93,71.41 | D27.C 58.93,84.62 | 58.93,84.62 58.93,77.98 | D28.C 58.93,89.12 58.93,84.62 | 58.93,71.41 58.93,68.58 58.17,67.82 40.13,67.82 39.62,68.33 R27.1
N$34  (via drill 0.35)
  Top 0.406: D56.C 40.93,118.14 41.66,118.87 45.47,118.87 | 45.47,118.87 49.28,118.87 50.07,118.08 D58.C 50.07,115.54 51.56,114.05 51.56,112.2 49.53,110.17 v49.53,109.47 49.53,105.09 R28.1 | D57.C 45.5,118.84 45.47,118.87 | D83.C D79.C 83.09,101.82 v83.06,101.85
  Bottom 0.406: v83.06,101.85 79.5,101.85 76.45,98.81 76.45,93.98 75.18,92.71 59.94,92.71 58.55,94.11 58.55,103.76 52.83,109.47 v49.53,109.47
N$35  (via drill 0.35)
  Top 0.406: D59.C 40.93,112.23 41.4,111.76 45.47,111.76 | 45.47,111.76 48.26,111.76 | 48.26,111.76 49.53,111.76 50.07,112.3 D61.C | D60.C 45.5,111.79 45.47,111.76 | 48.26,111.76 v48.26,111 | R29.1 v47.12,96.01 | D78.C 66.04,109.22 64.01,107.19 64.01,104.9 v60.71,101.6
  Bottom 0.406: v47.12,96.01 48.77,96.01 49.78,97.03 49.78,99.06 49.02,99.82 48.01,99.82 47.5,100.33 47.5,101.35 52.58,106.43 52.58,107.19 51.82,107.95 51.05,107.95 48.01,104.9 47.24,104.9 46.74,105.41 46.74,106.17 48.26,107.7 v48.26,111 52.58,111 60.71,102.87 v60.71,101.6
N$36  (via drill 0.35)
  Top 0.406: D47.C D48.C D49.C 47.21,110.02 48.77,108.46 48.77,106.93 v47.75,105.92 | R30.1 49.46,100.84 v48.51,100.84 | D80.C 77.69,98.33 v77.72,98.3
  Bottom 0.406: v48.51,100.84 53.34,105.66 53.59,105.66 | 53.59,105.66 53.59,107.7 52.58,108.71 50.55,108.71 v47.75,105.92 | v77.72,98.3 77.72,93.47 75.69,91.44 59.69,91.44 57.66,93.47 57.66,103.25 55.24,105.66 53.59,105.66
N$37  (via drill 0.35)
  Top 0.406: D52.C D51.C D50.C 37.63,105.44 v36.32,104.14 | R31.1 67.63,100.84 70.87,100.84 72.64,99.06 v72.64,96.52 72.64,94.74 71.37,93.47 52.83,93.47 v50.55,95.76 | D81.C 80.99,106.17 v80.77,106.17
  Bottom 0.406: v50.55,95.76 49.53,94.74 45.72,94.74 v36.32,104.14 | v80.77,106.17 72.64,98.04 v72.64,96.52
N$38
  Top 0.406: D53.C D54.C D55.C 52.29,92.46 72.39,92.46 73.91,93.98 73.91,100.3 D82.C 68.93,101.82 R32.1
N$45  (via drill 0.35)
  Top 0.406: D68.C v56.13,131.1 D69.C D70.C D71.C | D76.C 56.68,118.91 v57.15,119.38 | R33.1 v59.69,107.7
  Bottom 0.406: v59.69,107.7 58.42,108.97 58.42,111.25 60.45,113.28 66.8,113.28 67.31,113.79 67.31,115.06 66.8,115.57 60.96,115.57 v57.15,119.38 58.67,120.9 58.67,124.46 56.13,127 v56.13,131.1
N$46  (via drill 0.35)
  Top 0.406: D72.C v56.13,125 D73.C D74.C D75.C | v56.64,112.78 56.61,112.81 D77.C 58.45,112.81 60.26,114.62 61.98,114.62 62.74,115.38 R34.1
  Bottom 0.406: v56.13,125 57.4,123.73 57.4,121.41 56.13,120.14 56.13,118.62 57.4,117.35 57.4,114.81 56.64,114.05 v56.64,112.78
N$47  (via drill 0.35)
  Top 0.406: D39.C 22.32,108.93 21.84,108.46 16.26,108.46 | D41.C 16.26,110.2 16.26,108.46 | D43.C 16.22,108.42 16.26,108.46 | 16.26,108.46 10.16,108.46 | 10.16,108.46 4.57,108.46 4.03,109 D40.C 4.03,112.23 v4.83,113.03 | D42.C 10.16,110.2 10.16,108.46 | v35.56,123.44 35.56,122.68 36.83,121.41 57.66,121.41 58.42,120.65 58.42,116.84 58.86,116.4 R35.1
  Bottom 0.406: v4.83,113.03 8.64,113.03 19.05,123.44 v35.56,123.44
N$48  (via drill 0.35)
  Top 0.406: D85.C D84.C 63.53,100.04 v63.5,100.08 | D45.C D46.C D44.C 22.32,104.87 v22.35,104.9 | v36.58,116.84 39.37,119.63 50.55,119.63 51.56,118.62 v51.56,115.57 | R36.1 v66.04,114.3 66.04,113.03 62.74,109.73 v59.69,109.73
  Bottom 0.406: v22.35,104.9 19.81,104.9 18.54,106.17 18.54,115.57 21.34,118.36 34.04,118.36 35.56,116.84 v36.58,116.84 | v51.56,115.57 53.09,115.57 54.61,114.05 54.61,111.25 55.37,110.49 56.39,110.49 60.2,114.3 v66.04,114.3 | v59.69,109.73 63.5,105.92 v63.5,100.08
N$49
  Top 0.406: D87.C D86.C 63.53,95.72 62.74,96.52 59.94,96.52 57.4,99.06 57.4,105.34 56.83,105.92 R37.1
NRST  (via drill 0.35)
  Top 0.203: U4.7 56.22,42.12 v49.53,35.43
  Top 0.254: R11.1 20.77,19.37 24.51,23.11 35.81,23.11 v42.42,29.72
  Top 0.406: SW1.3 11.74,19.37 C10.2 R11.1
  Bottom 0.203: v49.53,35.43 43.81,29.72 v42.42,29.72
TOUCH1
  Top 0.406: U4.14 56.28,48.64 63.75,48.64 64.52,49.4 P1.P$1
TOUCH2
  Top 0.406: U4.16 53.47,47.66 53.47,56.01 59.94,62.48 P2.P$1
TOUCH3
  Top 0.406: U4.15 58.04,51.31 58.04,53.34 62.48,57.78 70.61,57.78 72.39,59.56 P3.P$1
TOUCH4  (via drill 0.35)
  Top 0.406: U4.58 57.26,32.51 v57.28,32.51
  Bottom 0.406: P4.P$1 66.67,71.88 68.96,69.6 68.96,39.62 61.85,32.51 v57.28,32.51
  other vias: 65.28,71.88
TOUCH5  (via drill 0.35)
  Top 0.406: U4.28 43.14,42.04 40.13,42.04 v40.01,42.16
  Bottom 0.406: v40.01,42.16 39.37,42.16 34.67,46.86 28.19,46.86 21.59,53.47 P5.P$1
  other vias: 21.59,73.41
TOUCH6  (via drill 0.35)
  Top 0.406: U4.27 41.53,44.56 v41.53,45.59
  Bottom 0.406: v41.53,45.59 40.51,46.61 40.51,54.86 33.27,62.1 P6.P$1
  other vias: 33.27,99.57
TOUCH7  (via drill 0.35)
  Top 0.406: v45.85,45.34 45.85,45.28 44.11,43.54 44.11,42.9 U4.26
  Bottom 0.406: v45.85,45.34 47.12,46.61 47.12,48.13 54.36,55.37 P7.P$1
  other vias: 54.36,99.57
VCC  (via drill 0.35)
  Top 0.254: U1.6 v67.69,19.1
  Top 0.305: R5.2 61.83,21.58 v61.85,21.57 | C1.1 63.2,16.55 v63.2,15.19
  Bottom 0.254: v67.69,19.1 64.85,19.1 63.22,17.48 63.2,17.45 v63.2,15.19
  Bottom 0.305: v61.85,21.57 61.85,18.85 63.22,17.48
  pour Top (no thermals): 66.37,16.74 66.37,16.03 60.81,16.03 60.81,16.74
VIBR_SENS
  Top 0.203: U4.2 62.07,43.39 R15.1
  Top 0.406: SW2.1 73.68,81.41 77.6,77.49 77.6,59 R15.1

### Text on the board
tNames: ZIGGY v1.0 / Feb 2021 / Brian Boucher | GND | JTMS | JTCK | JTDI | JTDO | JTRST | 3V3
bNames: GND | JTMS | JTCK | JTDI | JTDO | JTRST | 3V3